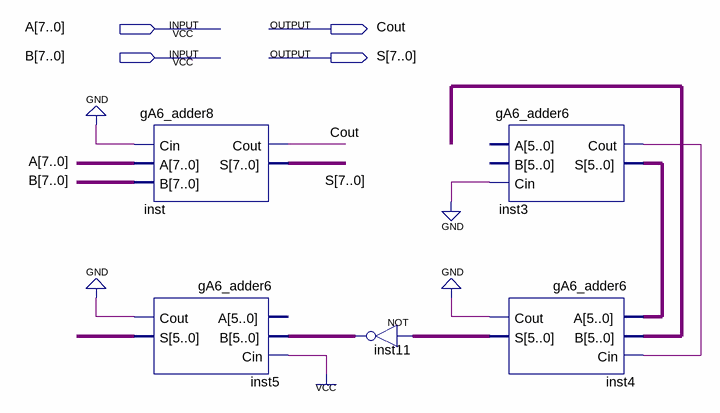
[diagram p0: schematic sheet]
// Quartus schematic gA6_Modulo_13.bdf as structural Verilog: 5 symbols, 4 pins
module gA6_Modulo_13 (
  input  [7:0] A,
  input  [7:0] B,
  output Cout,
  output [7:0] S
);

  wire inst3_cout, inst4_cout, inst5_cout;
  wire [5:0] inst3_s, inst4_s, inst5_s, inst11_out, undriven;

  gA6_adder8 inst (.Cin(1'b0), .A(A), .B(B), .Cout(Cout), .S(S));
  gA6_adder6 inst5 (.B(inst11_out), .Cin(1'b1), .Cout(inst5_cout), .S(inst5_s));  // open: A
  assign inst11_out = ~inst4_s;  // NOT inst11, 6 bits wide
  gA6_adder6 inst3 (.Cin(1'b0), .Cout(inst3_cout), .S(inst3_s));  // open: A, B
  gA6_adder6 inst4 (.A(inst3_s), .B(undriven), .Cin(inst3_cout), .Cout(inst4_cout), .S(inst4_s));
  // also tied to GND on the sheet: {inst4_cout, inst5_cout}
endmodule
